# Altium schematic sheet ethernet_dual_100mbe_ext_magn.SchDoc
size A4
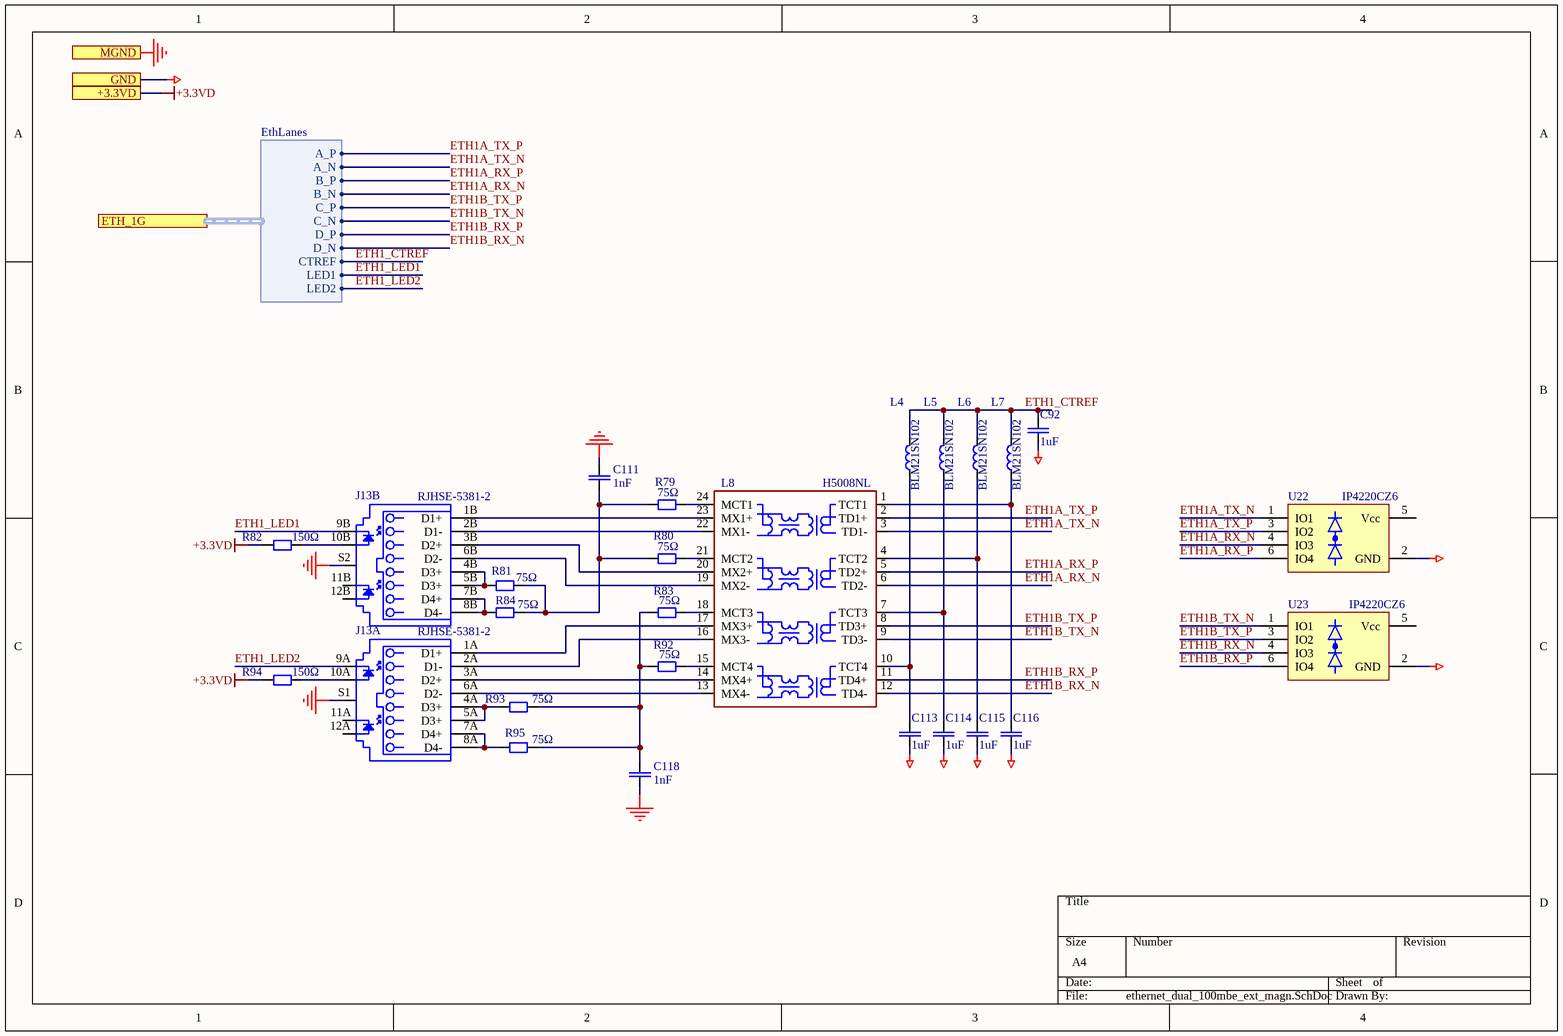
[diagram p0: ethernet_dual_100mbe_ext_magn.SchDoc]

## Parts
C92  1uF  [CAPC2012N]
C111  value 1nF  [CAPC3216N]  (hidden comment: 1nF; 2kV)
C113  1uF  [CAPC2012N]
C114  1uF  [CAPC2012N]
C115  1uF  [CAPC2012N]
C116  1uF  [CAPC2012N]
C118  value 1nF  [CAPC3216N]  (hidden comment: 1nF; 2kV)
J13  RJHSE-5381-2  [AMPH-RJHSE-5381-02_V]  (parts A,B of 2)
L4  value BLM21SN102  [INDC2012N]  (hidden comment: BLM21RK102SN1D)
L5  value BLM21SN102  [INDC2012N]  (hidden comment: BLM21RK102SN1D)
L6  value BLM21SN102  [INDC2012N]  (hidden comment: BLM21RK102SN1D)
L7  value BLM21SN102  [INDC2012N]  (hidden comment: BLM21RK102SN1D)
L8  H5008NL  [SMD_HX508]
R79  75Ω  [RESC2012N]
R80  75Ω  [RESC2012N]
R81  75Ω  [RESC2012N]
R82  150Ω  [RESC2012N]
R83  75Ω  [RESC2012N]
R84  75Ω  [RESC2012N]
R92  75Ω  [RESC2012N]
R93  75Ω  [RESC2012N]
R94  150Ω  [RESC2012N]
R95  75Ω  [RESC2012N]
U22  IP4220CZ6  [SOT95P285X110-6N]
U23  IP4220CZ6  [SOT95P285X110-6N]

## Ports
+3.3VD, ETH_1G (harness EthLanes), GND, MGND

## Harnesses
EthLanes: A_P, A_N, B_P, B_N, C_P, C_N, D_P, D_N, LED1, LED2, CTREF

## Nets
+3.3VD: R82.1 R94.1 ; port +3.3VD
GND: C92.1 C113.1 C114.1 C115.1 C116.1 U22.2(GND) U23.2(GND) ; port GND
MGND: C111.2 C118.1 J13.S1 J13.S2 ; port MGND
ETH1_CTREF: C92.2 L4.2 L5.2 L6.2 L7.2 ; port ETH_1G.CTREF
ETH1_LED1: J13.9B ; port ETH_1G.LED1
ETH1_LED2: J13.9A ; port ETH_1G.LED2
ETH1A_RX_N: L8.6(TD2-) U22.4(IO3) ; port ETH_1G.B_N
ETH1A_RX_P: L8.5(TD2+) U22.6(IO4) ; port ETH_1G.B_P
ETH1A_TX_N: L8.3(TD1-) U22.1(IO1) ; port ETH_1G.A_N
ETH1A_TX_P: L8.2(TD1+) U22.3(IO2) ; port ETH_1G.A_P
ETH1B_RX_N: L8.12(TD4-) U23.4(IO3) ; port ETH_1G.D_N
ETH1B_RX_P: L8.11(TD4+) U23.6(IO4) ; port ETH_1G.D_P
ETH1B_TX_N: L8.9(TD3-) U23.1(IO1) ; port ETH_1G.C_N
ETH1B_TX_P: L8.8(TD3+) U23.3(IO2) ; port ETH_1G.C_P
NetC111_1: C111.1 R79.1 R80.1 R81.2 R84.2
NetC113_2: C113.2 L4.1 L8.10(TCT4)
NetC114_2: C114.2 L5.1 L8.7(TCT3)
NetC115_2: C115.2 L6.1 L8.4(TCT2)
NetC116_2: C116.2 L7.1 L8.1(TCT1)
NetC118_2: C118.2 R83.1 R92.1 R93.2 R95.2
NetJ13_1A: J13.1A(D1+) L8.17(MX3+)
NetJ13_1B: J13.1B(D1+) L8.23(MX1+)
NetJ13_2A: J13.2A(D1-) L8.16(MX3-)
NetJ13_2B: J13.2B(D1-) L8.22(MX1-)
NetJ13_3A: J13.3A(D2+) L8.14(MX4+)
NetJ13_3B: J13.3B(D2+) L8.20(MX2+)
NetJ13_4A: J13.4A(D3+) J13.5A(D3+) R93.1
NetJ13_4B: J13.4B(D3+) J13.5B(D3+) R81.1
NetJ13_6A: J13.6A(D2-) L8.13(MX4-)
NetJ13_6B: J13.6B(D2-) L8.19(MX2-)
NetJ13_7A: J13.7A(D4+) J13.8A(D4-) R95.1
NetJ13_7B: J13.7B(D4+) J13.8B(D4-) R84.1
NetJ13_10A: J13.10A R94.2
NetJ13_10B: J13.10B R82.2
NetL8_15: L8.15(MCT4) R92.2
NetL8_18: L8.18(MCT3) R83.2
NetL8_21: L8.21(MCT2) R80.2
NetL8_24: L8.24(MCT1) R79.2

Not connected (* = marked no-connect by the designer): J13 11A(11) 11B(11) 12A(12) 12B(12); U22 5(Vcc); U23 5(Vcc)

## Library data of the parts
C92 C113-C116 = CAPC: Generic ceramic SMD capacitor; Pkg: 0805; Maintainer: Evgeniy Kotov; SMD Solders: 2; THD Solders: 0; Voltage Rating: 10V; PartField: 1uF; Last Change Data: 06.03.2017; Release Date: 06.03.2017; Value: 1uF
C111 C118 = CAPC: Generic ceramic SMD capacitor; Pkg: 1206; Maintainer: Evgeniy Kotov; SMD Solders: 2; THD Solders: 0; PartField: 1nF; Last Change Data: 06.03.2017; Release Date: 06.03.2017; VoltageRating: 2kV
J13 = RJ45-RJHSE-5381-2: Dual Port, High Speed RJ45, Modular Jack, 8 Position, 8 Contacts, Shielded, with LEDs, -55 to 85 degC,12-Pin THD, RoHS, Tray; Manufacturer: Amphenol; Number of Positions/Contacts: 8p8c(RJ45,Ethernet); Number of Ports: 1; Catalog Drawings: RJ45SeriesRightAngle; PCN Design/Specification: MultipleSeriesCopper29/Jan/2009RJHSEShieldMaterial30/Jun/2015; Other Names: RJHSE5381; Online Catalog: RJHSESeries; Featured Product: ModularJacksProductSolutions; Tab Direction: Up; Shielding: Shielded,EMIFinger; LED Color: Yellow-Green; 3D Model: RJHSE538x.stpRJHSE538x.igs; Pkg: LAN x2; SMD Solders: 0; THD Solders: 28; Category: Connectors,Interconnects; Termination: Solder; Housing Material: Thermoplastic; Mounting Type: ThroughHole; Family: ModularConnectors-Jacks; Orientation: 90°Angle(Right); Features: BoardLock; Contact Material: PhosphorBronze; Mounting Technology: ThroughHole; Number of Rows: 1; Standard Package: 120; Ratings: -; Operating Temperature: -55°C~85°C; Series: RJHSE; Contact Finish: Gold; Package Reference: RJHSE-5381; Ingress Protection: -; Package Description: 12-Pin Through Hole Device, Body 16.51 x 15.75 mm; Contact Finish Thickness: 50µin(1.27µm); Datasheet URL: https://datasheet.ciiva.com/16481/rjhse538x-16481714.pdf; Datasheet Version: Rev. K, 04/2014; Connector Type: Jack; Manufacturer URL: http://www.amphenol.com/; Packaging: Tray; PartField: RJHSE-5381-2; Value: RJHSE-5381-2
L4-L7 = BLM21RK102SN1D: Ferrite Beads, 0805, 1 kOhm; Pkg: 0805; Vendor: Murata; Maintainer: Evgeniy Kotov; SMD Solders: 2; THD Solders: 0; DC Current: 200mA; Tolerance: 25%; DC Resistance: 500mΩ; PartField: BLM21RK102SN1D; Release Date: 30.03.2017; Last Change Data: 30.03.2017; Temperature Range: -55°C to +125°C
L8 = LAN_1G_TR_H5008NL: LAN Transformer fog 1GbE, 12 coils, 4 pairs.; Vendor: Pulse Electronics; Maintainer: Evgeniy Kotov; SMD Solders: 2; THD Solders: 0; Tolerance: 2%; PartField: H5008NL; Pkg: H5008NL; Release Date: 31.03.2017; Last Change Data: 31.03.2017; Temperature Range: -25°C to +85°C; Value: H5008NL
R79-R84 R92-R95 = RESC: Resistor, Generic, SMD; Pkg: 0805; Maintainer: Evgeniy Kotov; SMD Solders: 2; THD Solders: 0; Release Date: 06.03.2017; Last Change Data: 09.03.2017
  R79-R81 R83 R84 R92 R93 R95: PartField: 75Ω; Value: 75Ω
  R82 R94: PartField: 150Ω; Value: 150Ω
U22 U23 = IP4220CZ6: Transimpedance Amplifier; Selectable-Feedback Resistance; Pkg: SOT457; SMD Solders: 6; THD Solders: 0; Maintainer: Evgeniy Kotov; Vendor: NXP; PartField: IP4220CZ6; ComponentLink1URL: http://assets.nexperia.com/documents/data-sheet/IP4220CZ6.pdf; ComponentLink1Description: Datasheet; Last Change Date: 28.03.2017; Release Date: 28.03.2017; Value: IP4220CZ6